# Altium schematic sheet AFE.SchDoc: Sensor
size 420 x 297 mm; CheckedBy: -; Author: G.Kasprowicz; CompanyName: WUT ISE; DrawnBy: G.Kasprowicz; Organization: WUT ISE; Address1: PW ISE; Address2: Nowowiejska 15/19 00-665 Warsaw; Address3: gkasprow@gmail.com; DocumentNumber: 2; SheetNumber: 2; SheetTotal: 6; ModifiedBy: -; CreateDate: -; CheckedDate: -; Title2: ADC; DivGrp: WUT ISE; Designer: G.Kasprowicz; ModifiedDate: -; ProjectName: Sensor Box
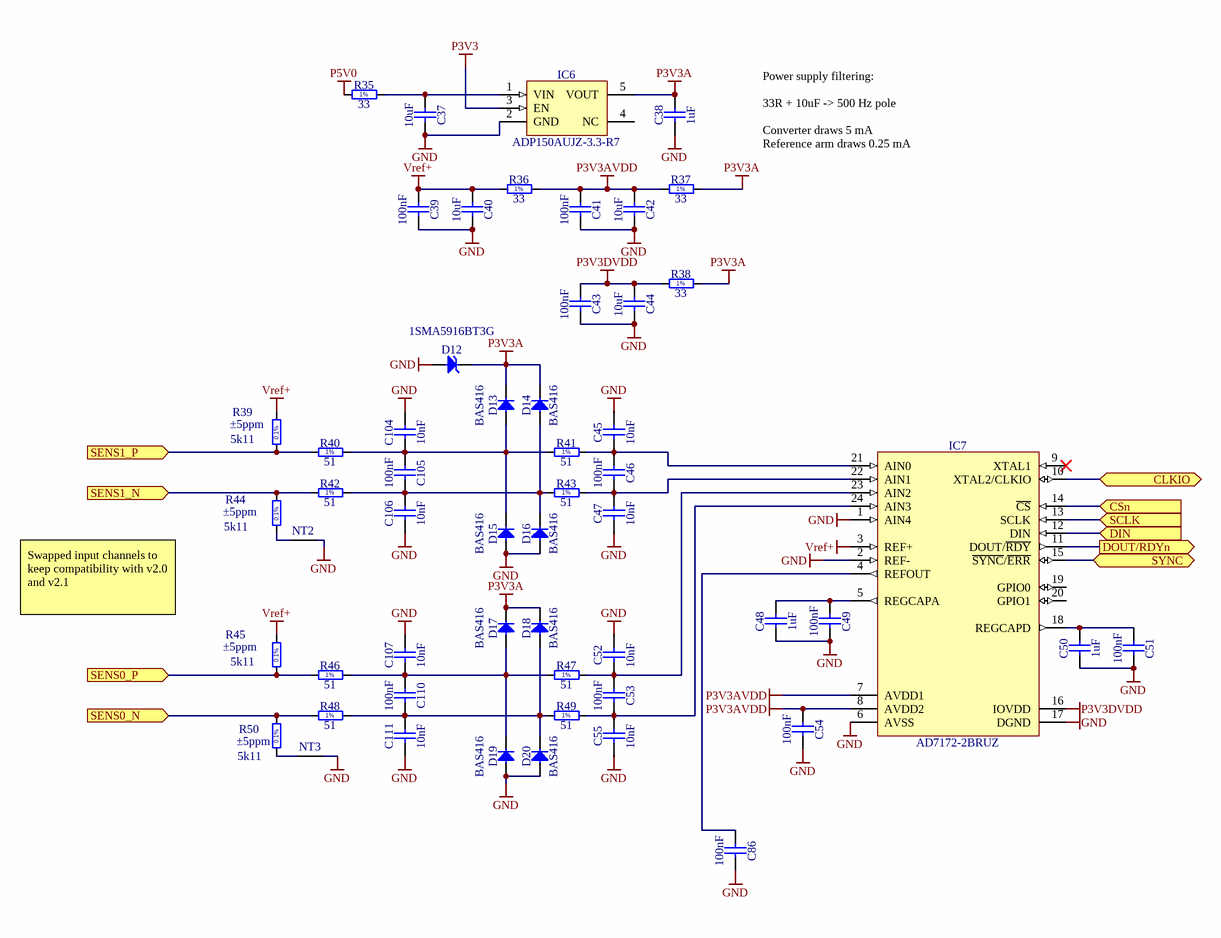
[diagram p0: AFE.SchDoc]

## Parts
C37  10uF  [CAPC2012X135N]
C38  1uF  [CAPC1608X87N]
C39  100nF  [CAPC1005X55N]
C40  10uF  [CAPC2012X135N]
C41  100nF  [CAPC1005X55N]
C42  10uF  [CAPC2012X135N]
C43  100nF  [CAPC1005X55N]
C44  10uF  [CAPC2012X135N]
C45  10nF  [CAPC1005X55N]
C46  100nF  [CAPC1005X55N]
C47  10nF  [CAPC1005X55N]
C48  1uF  [CAPC1608X87N]
C49  100nF  [CAPC1005X55N]
C50  1uF  [CAPC1608X87N]
C51  100nF  [CAPC1005X55N]
C52  10nF  [CAPC1005X55N]
C53  100nF  [CAPC1005X55N]
C54  100nF  [CAPC1005X55N]
C55  10nF  [CAPC1005X55N]
C86  100nF  [CAPC1005X55N]
C104  10nF  [CAPC1005X55N]
C105  100nF  [CAPC1005X55N]
C106  10nF  [CAPC1005X55N]
C107  10nF  [CAPC1005X55N]
C110  100nF  [CAPC1005X55N]
C111  10nF  [CAPC1005X55N]
D12  1SMA5916BT3G  [DIOM5226X220N]
D13  BAS416  [SOD2512X110N]
D14  BAS416  [SOD2512X110N]
D15  BAS416  [SOD2512X110N]
D16  BAS416  [SOD2512X110N]
D17  BAS416  [SOD2512X110N]
D18  BAS416  [SOD2512X110N]
D19  BAS416  [SOD2512X110N]
D20  BAS416  [SOD2512X110N]
IC6  ADP150AUJZ-3.3-R7  [SOT95P280X90-5N]
IC7  AD7172-2BRUZ  [SOP65P640X120-24N]
NT2  Net Tie  [Net Tie]  (value not drawn)  (net tie, no BOM)
NT3  Net Tie  [Net Tie]  (value not drawn)  (net tie, no BOM)
R35  33  [RESC1005X40N]
R36  33  [RESC1005X40N]
R37  33  [RESC1005X40N]
R38  33  [RESC1005X40N]
R39  5k11  TC: ±5ppm  [RESC1608X55N]
R40  51  [RESC1005X40N]
R41  51  [RESC1005X40N]
R42  51  [RESC1005X40N]
R43  51  [RESC1005X40N]
R44  5k11  TC: ±5ppm  [RESC1608X55N]
R45  5k11  TC: ±5ppm  [RESC1608X55N]
R46  51  [RESC1005X40N]
R47  51  [RESC1005X40N]
R48  51  [RESC1005X40N]
R49  51  [RESC1005X40N]
R50  5k11  TC: ±5ppm  [RESC1608X55N]

## Ports
CLKIO (bidir), CSn (in), DIN (in), DOUT/RDYn (out), SCLK (in), SENS0_N (in), SENS0_P (in), SENS1_N (in), SENS1_P (in), SYNC (bidir)

## Nets
GND: C37.2 C38.1 C39.2 C40.2 C41.2 C42.2 C43.2 C44.2 C45.2 C47.1 C48.1 C49.2 C50.1 C51.2 C52.2 C54.2 C55.1 C86.2 C104.2 C106.1 C107.2 C111.1 D12.2(A) D15.2(A) D16.2(A) D19.2(A) D20.2(A) IC6.2(GND) IC7.1(AIN4) IC7.2(REF-) IC7.6(AVSS) IC7.17(DGND) NT2.2 NT3.2
P3V3: IC6.3(EN)
P3V3A: C38.2 D12.1(C) D13.1(C) D14.1(C) D17.1(C) D18.1(C) IC6.5(VOUT) R37.2 R38.2
P3V3AVDD: C41.1 C42.1 C54.1 IC7.7(AVDD1) IC7.8(AVDD2) R36.2 R37.1
P3V3DVDD: C43.1 C44.1 IC7.16(IOVDD) R38.1
P5V0: R35.1
Vref+: C39.1 C40.1 IC7.3(REF+) R36.1 R39.2 R45.2
CLKIO: IC7.10(XTAL2/CLKIO) ; port CLKIO
CSn: IC7.14(~{CS}) ; port CSn
DIN: IC7.12(DIN) ; port DIN
DOUT/RDYn: IC7.11(DOUT/~{RDY}) ; port DOUT/RDYn
SCLK: IC7.13(SCLK) ; port SCLK
SENS0_N: R48.1 R50.2 ; port SENS0_N
SENS0_P: R45.1 R46.1 ; port SENS0_P
SENS1_N: R42.1 R44.2 ; port SENS1_N
SENS1_P: R39.1 R40.1 ; port SENS1_P
SYNC: IC7.15(~{SYNC}/~{ERR}) ; port SYNC
NetC37_1: C37.1 IC6.1(VIN) R35.2
NetC45_1: C45.1 C46.1 IC7.21(AIN0) R41.2
NetC46_2: C46.2 C47.2 IC7.22(AIN1) R43.2
NetC48_2: C48.2 C49.1 IC7.5(REGCAPA)
NetC50_2: C50.2 C51.1 IC7.18(REGCAPD)
NetC52_1: C52.1 C53.1 IC7.23(AIN2) R47.2
NetC53_2: C53.2 C55.2 IC7.24(AIN3) R49.2
NetC86_1: C86.1 IC7.4(REFOUT)
NetC104_1: C104.1 C105.1 D13.2(A) D15.1(C) R40.2 R41.1
NetC105_2: C105.2 C106.2 D14.2(A) D16.1(C) R42.2 R43.1
NetC107_1: C107.1 C110.1 D17.2(A) D19.1(C) R46.2 R47.1
NetC110_2: C110.2 C111.2 D18.2(A) D20.1(C) R48.2 R49.1
NetNT2_1: NT2.1 R44.1
NetNT3_1: NT3.1 R50.1

Not connected (* = marked no-connect by the designer): IC6 4(NC); IC7 9(XTAL1)* 19(GPIO0) 20(GPIO1)

## Notes on the sheet
- Power supply filtering:
  33R + 10uF -> 500 Hz pole
  Converter draws 5 mA
  Reference arm draws 0.25 mA
- Swapped input channels to keep compatibility with v2.0 and v2.1
- Project/Equipment
- Document
- Designer
- Drawn by
- Check.by
- Copyright WUT ISE 2020.
  This documentation describes Open Hardware and is licensed under the CERN OHL v.1.2. You may redistribute and modify this documentation under the terms of the CERN OHL v.1.2. (http://ohwr.org/CERNOHL). This documentation is distributed WITHOUT ANY EXPRESS OR IMPLIED WARRANTY, INCLUDING OF MERCHANTABILITY, SATISFACTORY QUALITY AND FITNESS FOR A PARTICULAR PURPOSE. Please see the CERN OHL v.1.2 for applicable conditions.
- Contact
- File
- Last Mod.
- Print Date
- Sheet
- Size
- A3
- of
- Rev
- (in symbol R0402_33R_1%_0.0625W_100PPM) 1%
- (in symbol R0402_51R_1%_0.0625W_100PPM) 1%
- (in symbol RES_0603_5k11_0.1%_5ppm) 0.1%

## Library data of the parts
C37 C40 C42 C44 = CC0805_10UF_16V_10%_X5R: Non-polarised capacitor; Part Description: SMD Multilayer Chip Ceramic Capacitor; Manufacturer: GENERIC; Manufacturer1 Part Number: C0805C106K4PAC; Voltage: 16V; TC: X5R; Tolerance: ±10%; Part Number: CC0805_10UF_16V_10%_X5R; Component Kind: Standard; Component Type: Standard; Pin Count: 2; Value: 10uF; Status: Preferred; Manufacturer Part Number: CC0805_10UF_16V_10%_X5R; Case: 0805; Mounted: Yes; Socket: No; SMD: Yes; Manufacturer1 Example: KEMET; Manufacturer1 ComponentHeight: 1.4mm; HelpURL: \\cern.ch\dfs\Applications\Altium\Datasheets\CC1206_X5R_KEMET.pdf; Author: CERN DEM JLC; CreateDate: 03.12.2007; LatestRevisionDate: 03.12.2007; Sense: No
C38 C48 C50 = CC0603_1UF_25V_10%_X7R: Non-polarised capacitor; Part Description: SMD Multilayer Chip Ceramic Capacitor; Manufacturer: GENERIC; Manufacturer1 Part Number: GRM188R71E105KA12D; Voltage: 25V; TC: X7R; Tolerance: ±10%; Part Number: CC0603_1UF_25V_10%_X7R; Component Kind: Standard; Component Type: Standard; Pin Count: 2; Value: 1uF; Status: None; Manufacturer Part Number: CC0603_1UF_25V_10%_X7R; Case: 0603; Mounted: Yes; Socket: No; SMD: Yes; Sense: No; Manufacturer1 Example: MURATA; Manufacturer1 ComponentHeight: 0.9mm; HelpURL: \\cern.ch\dfs\Applications\Altium\Datasheets\CC0603_X7R_MURATA.pdf; Author: CERN DEM JLC; CreateDate: 18/01/2011; LatestRevisionDate: 18/01/2011
C39 C41 C43 C46 C49 C51 C53 C54 C86 C105 C110 = CC0402_100NF_16V_10%_X5R: Non-polarised capacitor; Part Description: SMD Multilayer Chip Ceramic Capacitor; Manufacturer: GENERIC; Manufacturer1 Part Number: GRM155R61C104KA88D; Voltage: 16V; TC: X5R; Tolerance: ±10%; Table: Capacitors SMD; Part Number: CC0402_100NF_16V_10%_X5R; Component Kind: Standard; Component Type: Standard; Pin Count: 2; Value: 100nF; Status: None; Manufacturer Part Number: CC0402_100NF_16V_10%_X5R; Case: 0402; Mounted: Yes; Socket: No; SMD: Yes; Manufacturer1 Example: MURATA; Manufacturer1 ComponentHeight: 0.55mm; HelpURL: \\cern.ch\dfs\Applications\Altium\Datasheets\CC0402_X5R_MURATA_GRM.pdf; Author: CERN DEM JLC; CreateDate: 2013-12-10; LatestRevisionDate: 2013-12-10
C45 C47 C52 C55 C104 C106 C107 C111 = CC0402_10NF_50V_10%_X7R: Non-polarised capacitor; Part Description: SMD Multilayer Chip Ceramic Capacitor; Manufacturer: GENERIC; Manufacturer1 Part Number: GRM155R71H103KA88D; Voltage: 50V; TC: X7R; Tolerance: ±10%; Part Number: CC0402_10NF_50V_10%_X7R; Component Kind: Standard; Component Type: Standard; Pin Count: 2; Value: 10nF; Status: None; Manufacturer Part Number: CC0402_10NF_50V_10%_X7R; Case: 0402; Mounted: Yes; Socket: No; SMD: Yes; Sense: No; Manufacturer1 Example: MURATA; Manufacturer1 ComponentHeight: 0.55mm; HelpURL: \\cern.ch\dfs\Applications\Altium\Datasheets\CC0402_X7R_MURATA_GRM.pdf; Author: CERN DEM MR; CreateDate: 08.01.2016; LatestRevisionDate: 08.01.2016
D12 = D_Zener_1SMA5916BT3G: 4.3V 1.5 Watt Plastic Surface Mount Zener Voltage Regulators; Manufacturer: ON SEMICONDUCTOR; Power: 1.5W; PressFit: No; Bonding: No; Part Number: 1SMA5916BT3G; Component Kind: Standard; Component Type: Standard; Device: 1SMA5916BT3G; PackageDescription: DO-214-AC/SMA Diode, Molded Body; 5.21mm L X 2.60mm W X 2.20mm H, IPC Medium Density; Voltage: 4.3V; Part Description: Zener Voltage Regulators; Manufacturer Part Number: 1SMA5916BT3G; Pin Count: 2; Case: DO-214AC; Mounted: Yes; Socket: No; SMD: Yes; Sense: No; ComponentHeight: 2.20mm; HelpURL: \\cern.ch\dfs\Applications\Altium\Datasheets\1SMA5913BT3G.pdf; Author: GK; CreateDate: 16/02/2018; LatestRevisionDate: 16/02/2018
D13-D20 = BAS416: Diode; Part Description: Low-Leakage Diode; Manufacturer: NXP SEMICONDUCTORS; Voltage: 75V; Power: 200mA; PressFit: No; Bonding: No; Part Number: BAS416; Component Kind: Standard; Component Type: Standard; Device: BAS416; PackageDescription: Small Outline Diode (SOD-323), 1.70mm W X 1.25mm L X 1.10mm H body,  IPC Medium Density; Manufacturer Part Number: BAS416; Pin Count: 2; Case: SOD323; Mounted: Yes; Socket: No; SMD: Yes; Sense: No; ComponentHeight: 1.1mm; HelpURL: \\cern.ch\dfs\Applications\Altium\Datasheets\BAS416.pdf; Author: CERN DEM JLC; CreateDate: 01/10/2013; LatestRevisionDate: 01/10/2013
IC6 = ADP150AUJZ-3.3-R7: Ultralow Noise, 150 mA CMOS Linear Regulator; Part Description: 3.3V, 150mA, Ultralow Noise, CMOS Linear Regulator; Manufacturer: ANALOG DEVICES; PressFit: No; Bonding: No; Part Number: ADP150AUJZ-3.3-R7; Component Kind: Standard; Component Type: Standard; Device: ADP150AUJZ-3.3-R7; PackageDescription: SOT23, 0.95mm pitch; 5 pin, 1.75mm W X 3.00mm L, IPC Medium Density; Manufacturer Part Number: ADP150AUJZ-3.3-R7; Pin Count: 5; Case: SOT23; Mounted: Yes; Socket: No; SMD: Yes; Sense: No; ComponentHeight: 0.9mm; HelpURL: \\cern.ch\dfs\Applications\Altium\Datasheets\ADP150AUJZ-3.3-R7.pdf; Author: CERN DEM JLC; CreateDate: 27/09/2011; LatestRevisionDate: 19/06/2014
IC7 = ADC_AD7172-2: 32-Bit, 10 kSPS, Sigma-Delta ADC with 100 µs Settling and True Rail-to-Rail Buffers; Part Description: Low Power, 24-Bit, 31.25 kSPS, Sigma-DeltaADC with True Rail-to-Rail Buffers; Manufacturer: ANALOG DEVICES; PressFit: No; Bonding: No; Part Number: AD7172-2BRUZ; Component Kind: Standard; Component Type: Standard; Device: AD7172-2BRUZ; PackageDescription: SOP, 0.65mm Pitch; 24 Pin, 4.40mm W X 5.00mm L X 1.20mm H Body IPC Medium Density; Manufacturer Part Number: AD7172-2BRUZ; Pin Count: 24; Case: TSSOP24; Mounted: Yes; Socket: No; SMD: Yes; Sense: No; ComponentHeight: 1.2mm; Author: GK; HelpURL: \\cern.ch\dfs\Applications\Altium\Datasheets\AD7177-2BRUZ.pdf; CreateDate: 14/12/2017; LatestRevisionDate: 14/12/2017
NT2 NT3 = Net Tie: Part Description: Net Tie (2 Nets); Mounted: No; Part Number: Net Tie; Component Type: Net Tie; Pin Count: 2; Family: Net Tie; Socket: No; SMD: No; Sense: No; Status: None; ComponentHeight: 0mm; HelpURL: Undefined; Author: CERN DEM JLC; CreateDate: 22.03.2011; LatestRevisionDate: 22.03.2011; PackageDescription: 2 Plated Through Hole For Coaxial Cable Link: Hole Dia.=1.4mm Pad Dia.=2.5mm
R35-R38 = R0402_33R_1%_0.0625W_100PPM: Resistor - 1%; Part Description: General Purpose Thick Film Chip Resistor; Manufacturer: GENERIC; Manufacturer1 Part Number: 232270673309L; TC: ±100ppm/°C; PressFit: No; Part Number: R0402_33R_1%_0.0625W_100PPM; Component Kind: Standard; Component Type: Standard; Pin Count: 2; Value: 33; Status: Not Recommended; Power: 0.0625W; Tolerance: ±1%; Manufacturer Part Number: R0402_33R_1%_0.0625W_100PPM; Case: 0402; Mounted: Yes; Sense: No; Socket: No; SMD: Yes; Manufacturer1 Example: YAGEO PHYCOMP; Manufacturer1 ComponentHeight: 0.4mm; HelpURL: \\cern.ch\dfs\Applications\Altium\Datasheets\R0402_Phycomp_RC0402.pdf; Author: CERN DEM JLC; CreateDate: 03/12/2007; LatestRevisionDate: 17/10/2012
R39 R44 R45 R50 = RES_0603_5k11_0.1%_5ppm: Resistor - 0.1%; Part Number: R0603_5K11_0.1%_0.063W_5PPM; Part Description: Thin Film Chip Resistor; Manufacturer: GENERIC; Manufacturer1 Part Number: TNPU06035K11BZEN00; Power: 0.063W; PressFit: No; Component Kind: Standard; Component Type: Standard; Pin Count: 2; Value: 5k11; Status: Not Recommended; Tolerance: ±0.1%; Manufacturer Part Number: R0603_5K11_0.1%_0.063W_5PPM; Case: 0603; Mounted: Yes; Sense: No; Socket: No; SMD: Yes; Manufacturer1 Example: Vishay Dale; Manufacturer1 ComponentHeight: 0.5mm; HelpURL: \\cern.ch\dfs\Applications\Altium\Datasheets\R0603_Tyco_RN73.pdf; Author: GK; CreateDate: 03/12/2007; LatestRevisionDate: 13/03/2008
R40-R43 R46-R49 = R0402_51R_1%_0.0625W_100PPM: Resistor - 1%; Part Description: General Purpose Thick Film Chip Resistor; Manufacturer: GENERIC; Manufacturer1 Part Number: 232270675109L; TC: ±100ppm/°C; PressFit: No; Part Number: R0402_51R_1%_0.0625W_100PPM; Component Kind: Standard; Component Type: Standard; Pin Count: 2; Value: 51; Status: Not Recommended; Power: 0.0625W; Tolerance: ±1%; Manufacturer Part Number: R0402_51R_1%_0.0625W_100PPM; Case: 0402; Mounted: Yes; Sense: No; Socket: No; SMD: Yes; Manufacturer1 Example: YAGEO PHYCOMP; Manufacturer1 ComponentHeight: 0.4mm; HelpURL: \\cern.ch\dfs\Applications\Altium\Datasheets\R0402_Phycomp_RC0402.pdf; Author: CERN DEM JLC; CreateDate: 03/12/2007; LatestRevisionDate: 17/10/2012